# EAGLE design led-er (EAGLE 7.2.0)
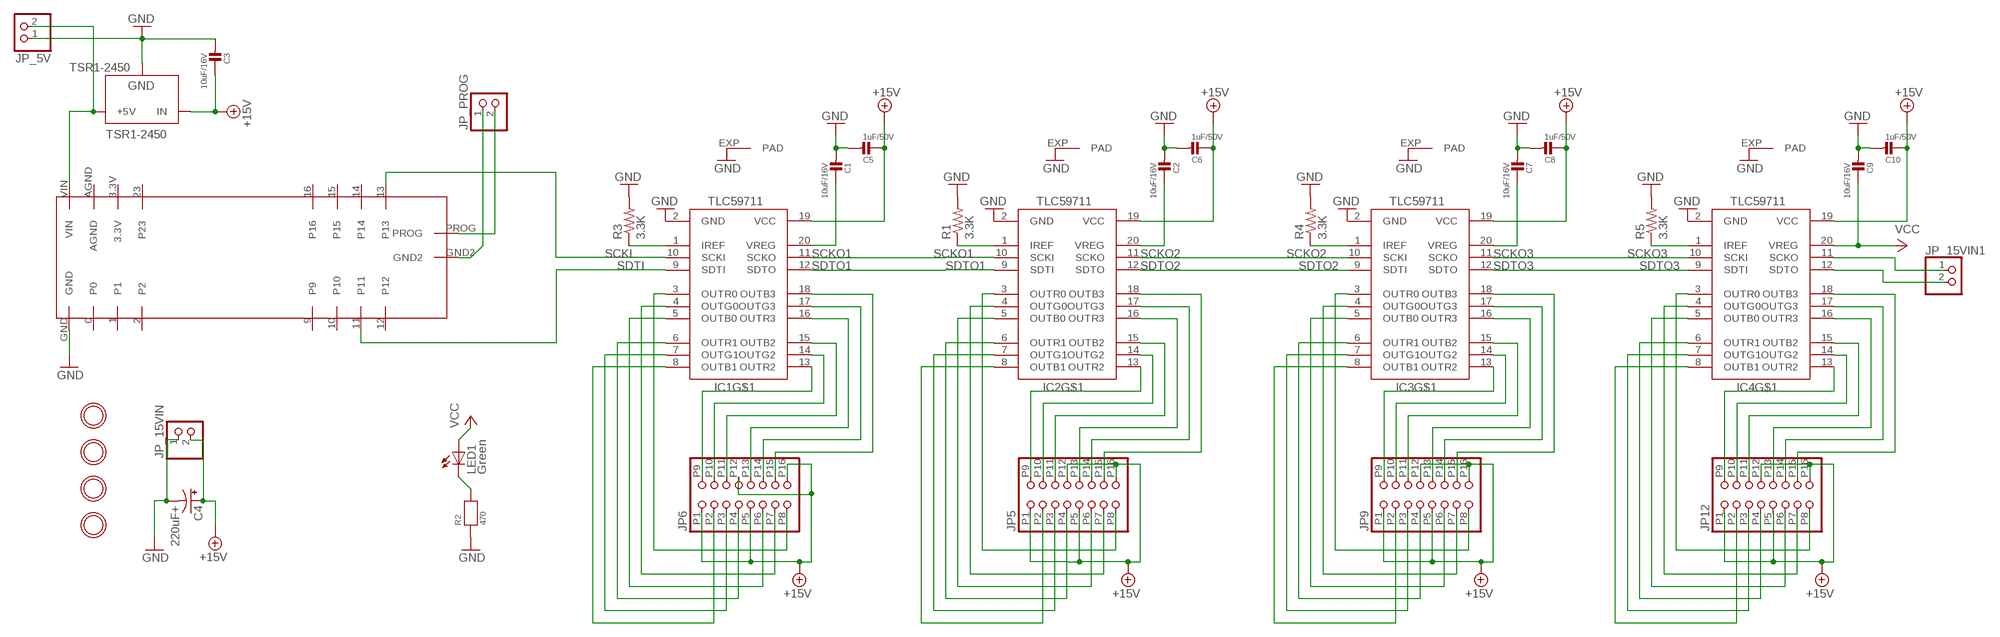
[diagram p0: schematic, sheet 1]

## Parts
C1  10uF/16V  CAP_CERAMIC0805  [0805]
C2  10uF/16V  CAP_CERAMIC0805  [0805]
C3  10uF/16V  CAP_CERAMIC0805  [0805]
C4  220uF+  CPOL-USE5-8.5  [E5-8,5]
C5  1uF/50V  CAP_CERAMIC0805  [0805]
C6  1uF/50V  CAP_CERAMIC0805  [0805]
C7  10uF/16V  CAP_CERAMIC0805  [0805]
C8  1uF/50V  CAP_CERAMIC0805  [0805]
C9  10uF/16V  CAP_CERAMIC0805  [0805]
C10  1uF/50V  CAP_CERAMIC0805  [0805]
IC1  TLC59711  [HTSSOP20DAP]
IC2  TLC59711  [HTSSOP20DAP]
IC3  TLC59711  [HTSSOP20DAP]
IC4  TLC59711  [HTSSOP20DAP]
JP5  HEADER-2X8  [2X08]
JP6  HEADER-2X8  [2X08]
JP9  HEADER-2X8  [2X08]
JP12  HEADER-2X8  [2X08]
JP_5V  HEADER-1X2  [1X02_OVAL]
JP_15VIN  HEADER-1X2  [1X02_OVAL]
JP_15VIN1  HEADER-1X2  [1X02_OVAL]
JP_PROG  HEADER-1X2  [1X02_OVAL]
LED1  Green  LEDCHIP-LED0805  [CHIP-LED0805]
R1  3.3K  R-US_FLIPFLOP7  [0805-THM-7]
R2  470  RESISTOR0805  [0805]
R3  3.3K  R-US_FLIPFLOP7  [0805-THM-7]
R4  3.3K  R-US_FLIPFLOP7  [0805-THM-7]
R5  3.3K  R-US_FLIPFLOP7  [0805-THM-7]
TSR1-2450  TSR1-2450  [TSR-1]
U$1  MOUNTINGHOLE  [MOUNTINGHOLE_3.0_PLATED]
U$2  MOUNTINGHOLE  [MOUNTINGHOLE_3.0_PLATED]
U$3  MOUNTINGHOLE  [MOUNTINGHOLE_3.0_PLATED]
U$4  MOUNTINGHOLE  [MOUNTINGHOLE_3.0_PLATED]
U$5  TEENSY_LEDER  [TEENSY_LEDER]

## Nets
+15V: C3.1 C4.+ C5.1 C6.1 C8.1 C10.1 IC1.19(VCC) IC2.19(VCC) IC3.19(VCC) IC4.19(VCC) JP5.P1 JP5.P5 JP5.P12 JP5.P16 JP6.P1 JP6.P5 JP6.P12 JP6.P16 JP9.P1 JP9.P5 JP9.P12 JP9.P16 JP12.P1 JP12.P5 JP12.P12 JP12.P16 JP_15VIN.2 TSR1-2450.1(IN)
GND: C1.2 C2.2 C3.2 C4.- C5.2 C6.2 C7.2 C8.2 C9.2 C10.2 IC1.2(GND) IC1.EXP(PAD) IC2.2(GND) IC2.EXP(PAD) IC3.2(GND) IC3.EXP(PAD) IC4.2(GND) IC4.EXP(PAD) JP_5V.1 JP_15VIN.1 R1.2 R2.1 R3.2 R4.2 R5.2 TSR1-2450.2(GND) U$5.GND
JP1: JP_5V.2 TSR1-2450.3(+5V) U$5.VIN
N$1: LED1.C R2.2
N$2: IC1.1(IREF) R3.1
N$3: IC1.3(OUTR0) JP6.P8
N$4: IC1.4(OUTG0) JP6.P7
N$5: IC1.5(OUTB0) JP6.P6
N$6: IC1.6(OUTR1) JP6.P4
N$7: IC1.7(OUTG1) JP6.P3
N$8: IC1.8(OUTB1) JP6.P2
N$9: IC1.13(OUTR2) JP6.P9
N$10: IC1.14(OUTG2) JP6.P10
N$11: IC1.15(OUTB2) JP6.P11
N$12: IC1.16(OUTR3) JP6.P13
N$13: IC1.17(OUTG3) JP6.P14
N$14: IC1.18(OUTB3) JP6.P15
N$15: IC2.1(IREF) R1.1
N$16: IC2.3(OUTR0) JP5.P8
N$17: IC2.4(OUTG0) JP5.P7
N$18: IC2.5(OUTB0) JP5.P6
N$19: IC2.6(OUTR1) JP5.P4
N$20: IC2.7(OUTG1) JP5.P3
N$21: IC2.8(OUTB1) JP5.P2
N$22: IC2.13(OUTR2) JP5.P9
N$23: IC2.14(OUTG2) JP5.P10
N$24: IC2.15(OUTB2) JP5.P11
N$25: IC2.16(OUTR3) JP5.P13
N$26: IC2.17(OUTG3) JP5.P14
N$27: IC2.18(OUTB3) JP5.P15
N$28: IC3.1(IREF) R4.1
N$29: IC3.3(OUTR0) JP9.P8
N$30: IC3.4(OUTG0) JP9.P7
N$31: IC3.5(OUTB0) JP9.P6
N$32: IC3.6(OUTR1) JP9.P4
N$33: IC3.7(OUTG1) JP9.P3
N$34: IC3.8(OUTB1) JP9.P2
N$35: IC3.13(OUTR2) JP9.P9
N$36: IC3.14(OUTG2) JP9.P10
N$37: IC3.15(OUTB2) JP9.P11
N$38: IC3.16(OUTR3) JP9.P13
N$39: IC3.17(OUTG3) JP9.P14
N$40: IC3.18(OUTB3) JP9.P15
N$41: IC4.1(IREF) R5.1
N$42: IC4.3(OUTR0) JP12.P8
N$43: IC4.4(OUTG0) JP12.P7
N$44: IC4.5(OUTB0) JP12.P6
N$45: IC4.6(OUTR1) JP12.P4
N$46: IC4.7(OUTG1) JP12.P3
N$47: IC4.8(OUTB1) JP12.P2
N$48: IC4.13(OUTR2) JP12.P9
N$49: IC4.14(OUTG2) JP12.P10
N$50: IC4.15(OUTB2) JP12.P11
N$51: IC4.16(OUTR3) JP12.P13
N$52: IC4.17(OUTG3) JP12.P14
N$53: IC4.18(OUTB3) JP12.P15
N$54: JP_PROG.1 U$5.GND2
N$55: JP_PROG.2 U$5.PROG
N$56: C1.1 IC1.20(VREG)
N$57: C7.1 IC3.20(VREG)
N$58: C2.1 IC2.20(VREG)
N$59: IC4.11(SCKO) JP_15VIN1.1
N$60: IC4.12(SDTO) JP_15VIN1.2
SCKI: IC1.10(SCKI) U$5.13
SCKO1: IC1.11(SCKO) IC2.10(SCKI)
SCKO2: IC2.11(SCKO) IC3.10(SCKI)
SCKO3: IC3.11(SCKO) IC4.10(SCKI)
SDTI: IC1.9(SDTI) U$5.11
SDTO1: IC1.12(SDTO) IC2.9(SDTI)
SDTO2: IC2.12(SDTO) IC3.9(SDTI)
SDTO3: IC3.12(SDTO) IC4.9(SDTI)
VCC: C9.1 IC4.20(VREG) LED1.A
Unconnected: U$5.0 U$5.1 U$5.2 U$5.3.3V U$5.9 U$5.10 U$5.12 U$5.14 U$5.15 U$5.16 U$5.23 U$5.AGND

## Library data of the parts
C1-C3 C5-C10 = microbuilder:CAP_CERAMIC: Ceramic Capacitors For new designs, use the packages preceded by an '_' character since they are more reliable: The following footprints should be used on most boards: _0402 - Standard footprint for regular board layouts _0603 - Standard footprint for regular board layouts _0805 - Standard footprint for regular board layouts For extremely tight-pitch boards where space is at a premium, the following 'micro-pitch' footprints can be used (smaller pads, no silkscreen outline, etc.): _0402MP - Micro-pitch footprint for very dense/compact boards _0603MP - Micro-pitch footprint for very dense/compact boards _0805MP - Micro-pitch footprint for very dense/compact boards Commonly Stocked Parts 0402 - 0402 Surface Mount Capacitors 16pF 50V 5% [Digikey: 445-4899-2-ND] 18pF 50V 5% [Digikey: 490-1281-2-ND] 22pF 50V 5% [Digikey: 490-1283-2-ND] 68pF 50V 5% [Digikey: 490-1289-2-ND] 0.1uF 10V 10% [Digikey: 490-1318-2-ND] 1.0uF 6.3V 10% [Digikey: 490-1320-2-ND] 0603 - 0603 Surface Mount Capacitors 16 pF 50V 5% [Digikey: 445-5051-2-ND] 22 pF 50V [Digikey: PCC220ACVTR-ND] 33 pF 50V 5% [Digikey: 490-1415-1-ND] 56pF 50V 5% [Digikey: 490-1421-1-ND] 220pF 50V 5% [Digikey: 445-1285-1-ND] 680 pF 50V 2200 pF 50V 5% C0G [Digikey: 445-1297-1-ND] 5600 pF 100V 5% X7R [Digikey: 478-3711-1-ND] 0.1 µF 25V 10% [Digikey: PCC2277TR-ND] 0.22 µF 16V 10% X7R [Digikey: 445-1318-1-ND] 1.0 µF 25V 10% [Digikey: 445-5146-2-ND] 0603 - RF Specific 3pF 250V +/-0.1pF RF [Digikey: 712-1347-1-ND] 18 pF 250V 5% [Digikey: 478-3505-1-ND or 712-1322-1-ND] 56 pF 250V 5% C0G RF [Digikey: 490-4867-1-ND] 68 pF 250V RF [Digikey: 490-4868-1-ND] 0805 - 0805 Surface Mount Capacitors 220 pF 250V 2% RF Ceramic Capacitor [Digikey: 712-1398-1-ND] 1000 pF 50V 2% NP0 Ceramic Capacitor [Digikey: 478-3760-1-ND] 0.1 µF 25V 10% Ceramic Capacitor [Digikey: PCC1828TR-ND] 1.0 µF 16V 10% Ceramic Capacitor[Digikey: 490-1691-2-ND] 10.0 µF 10V 10% Ceramic Capacitor[Digikey: 709-1228-1-ND] 10.0 uF 16V 10% Ceramic Capacitor [Digikey: 478-5165-2-ND] 47 uF 6.3V 20% Ceramic Capacitor [Digikey: 587-1779-1-ND or 399-5506-1-ND] 1206 - 1206 Surface Mount Capacitors 47uF 10V 20% Ceramic Capacitor [Digikey: 490-5528-1-ND or 399-5508-1-ND or 445-6010-1-ND] 100uF 6.3V -20%, +80% Y5V Ceramic Capacitor (Digikey: 490-4512-1-ND, Mouser: 81-GRM31CF50J107ZE1L)
C4 = adafruit:CPOL-US: POLARIZED CAPACITOR, American symbol
IC1-IC4 = adafruit:TLC59711
JP5 JP6 JP9 JP12 = Andrews:HEADER-2X8: 2x8 shrouded header
JP_5V JP_15VIN JP_15VIN1 JP_PROG = microbuilder:HEADER-1X2: PIN HEADER
LED1 = adafruit:LED: LED OSRAM: - CHIPLED LG R971, LG N971, LY N971, LG Q971, LY Q971, LO R971, LY R971 LH N974, LH R974 LS Q976, LO Q976, LY Q976 LO Q996 - Hyper CHIPLED LW Q18S LB Q993, LB Q99A, LB R99A - SideLED LS A670, LO A670, LY A670, LG A670, LP A670 LB A673, LV A673, LT A673, LW A673 LH A674 LY A675 LS A676, LA A676, LO A676, LY A676, LW A676 LS A679, LY A679, LG A679 - Hyper Micro SIDELED® LS Y876, LA Y876, LO Y876, LY Y876 LT Y87S - SmartLED LW L88C, LW L88S LB L89C, LB L89S, LG L890 LS L89K, LO L89K, LY L89K LS L896, LA L896, LO L896, LY L896 - TOPLED LS T670, LO T670, LY T670, LG T670, LP T670 LSG T670, LSP T670, LSY T670, LOP T670, LYG T670 LG T671, LOG T671, LSG T671 LB T673, LV T673, LT T673, LW T673 LH T674 LS T676, LA T676, LO T676, LY T676, LB T676, LH T676, LSB T676, LW T676 LB T67C, LV T67C, LT T67C, LS T67K, LO T67K, LY T67K, LW E67C LS E67B, LA E67B, LO E67B, LY E67B, LB E67C, LV E67C, LT E67C LW T67C LS T679, LY T679, LG T679 LS T770, LO T770, LY T770, LG T770, LP T770 LB T773, LV T773, LT T773, LW T773 LH T774 LS E675, LA E675, LY E675, LS T675 LS T776, LA T776, LO T776, LY T776, LB T776 LHGB T686 LT T68C, LB T68C - Hyper Mini TOPLED® LB M676 - Mini TOPLED Santana® LG M470 LS M47K, LO M47K, LY M47K Source: http://www.osram.convergy.de/
R1 R3-R5 = adafruit:R-US_: RESISTOR, American symbol
R2 = microbuilder:RESISTOR: Resistors For new designs, use the packages preceded by an '_' character since they are more reliable: The following footprints should be used on most boards: _0402 - Standard footprint for regular board layouts _0603 - Standard footprint for regular board layouts _0805 - Standard footprint for regular board layouts For extremely tight-pitch boards where space is at a premium, the following 'micro-pitch' footprints can be used (smaller pads, no silkscreen outline, etc.): _0402MP - Micro-pitch footprint for very dense/compact boards _0603MP - Micro-pitch footprint for very dense/compact boards _0805MP - Micro-pitch footprint for very dense/compact boards
TSR1-2450 = SteelCaveRobotics-Power:TSR1-2450: Traco Power TSR 1-2450 5.0v switching regulator
U$1-U$4 = microbuilder:MOUNTINGHOLE: Mounting Hole For #2 screws (0.086"/2.18mm width, 0.094"/2.4mm hole) use 2.5mm
U$5 = Andrews:TEENSY_LEDER

## Board
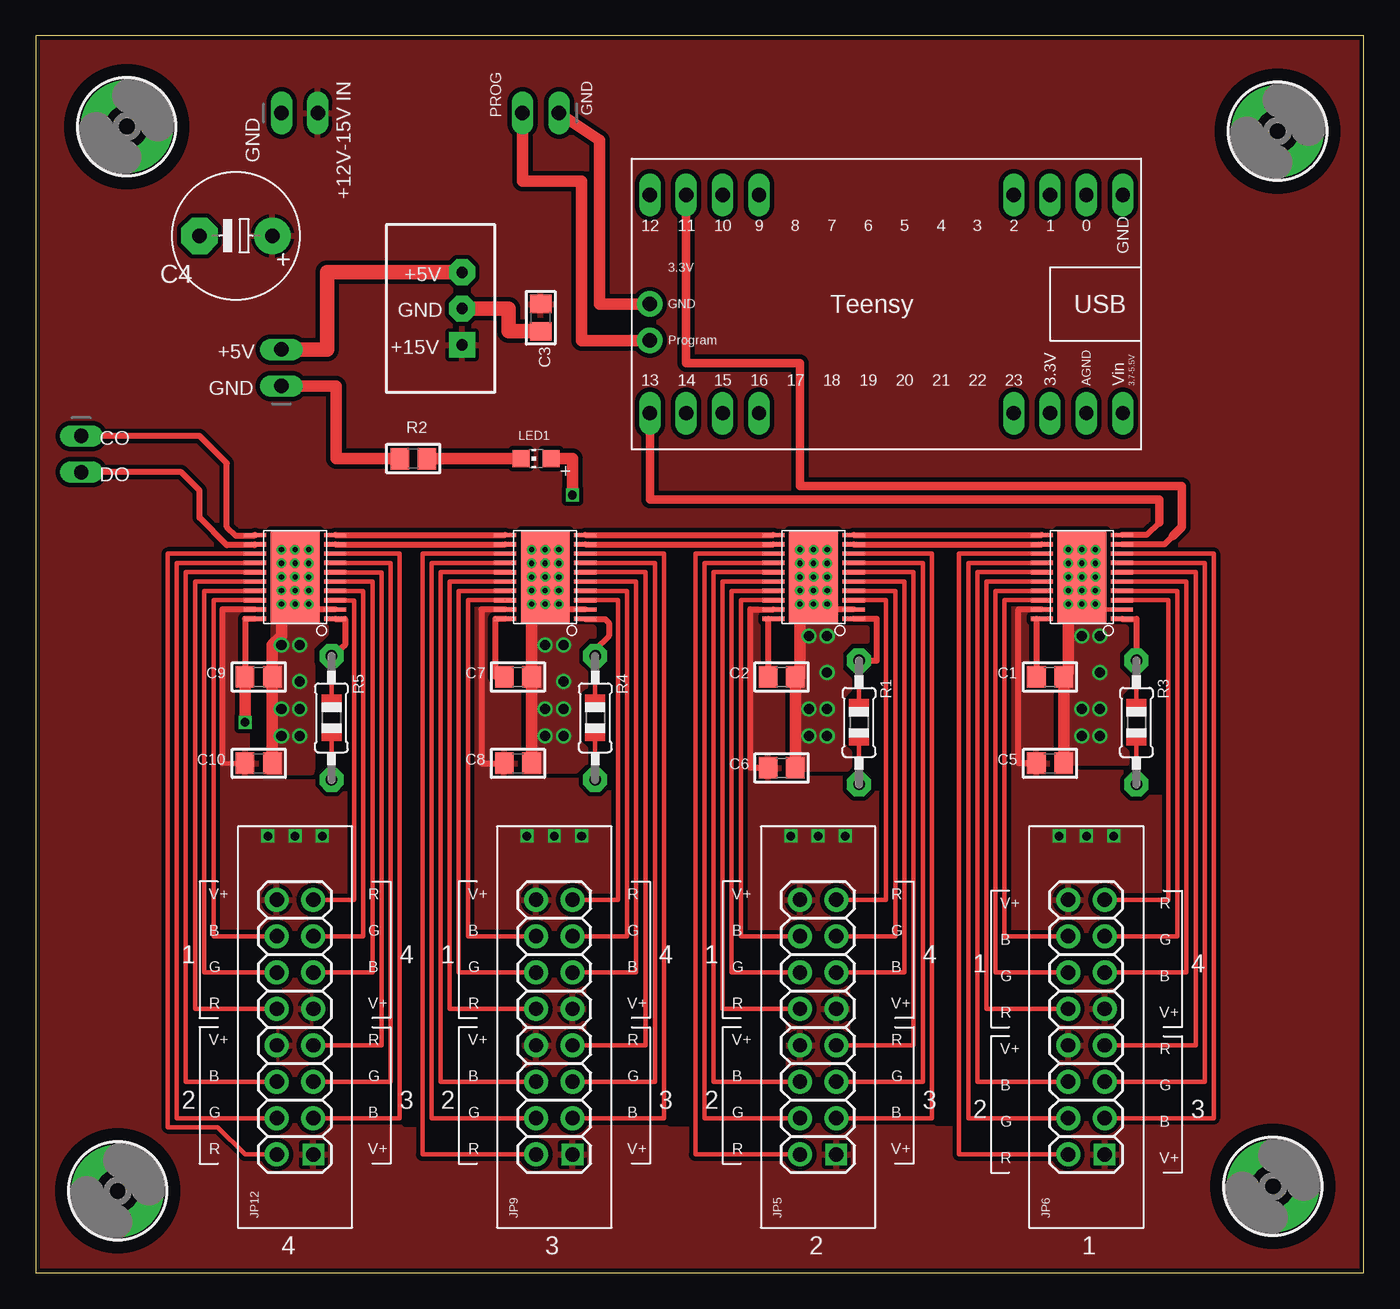
[diagram p1: board, top side]
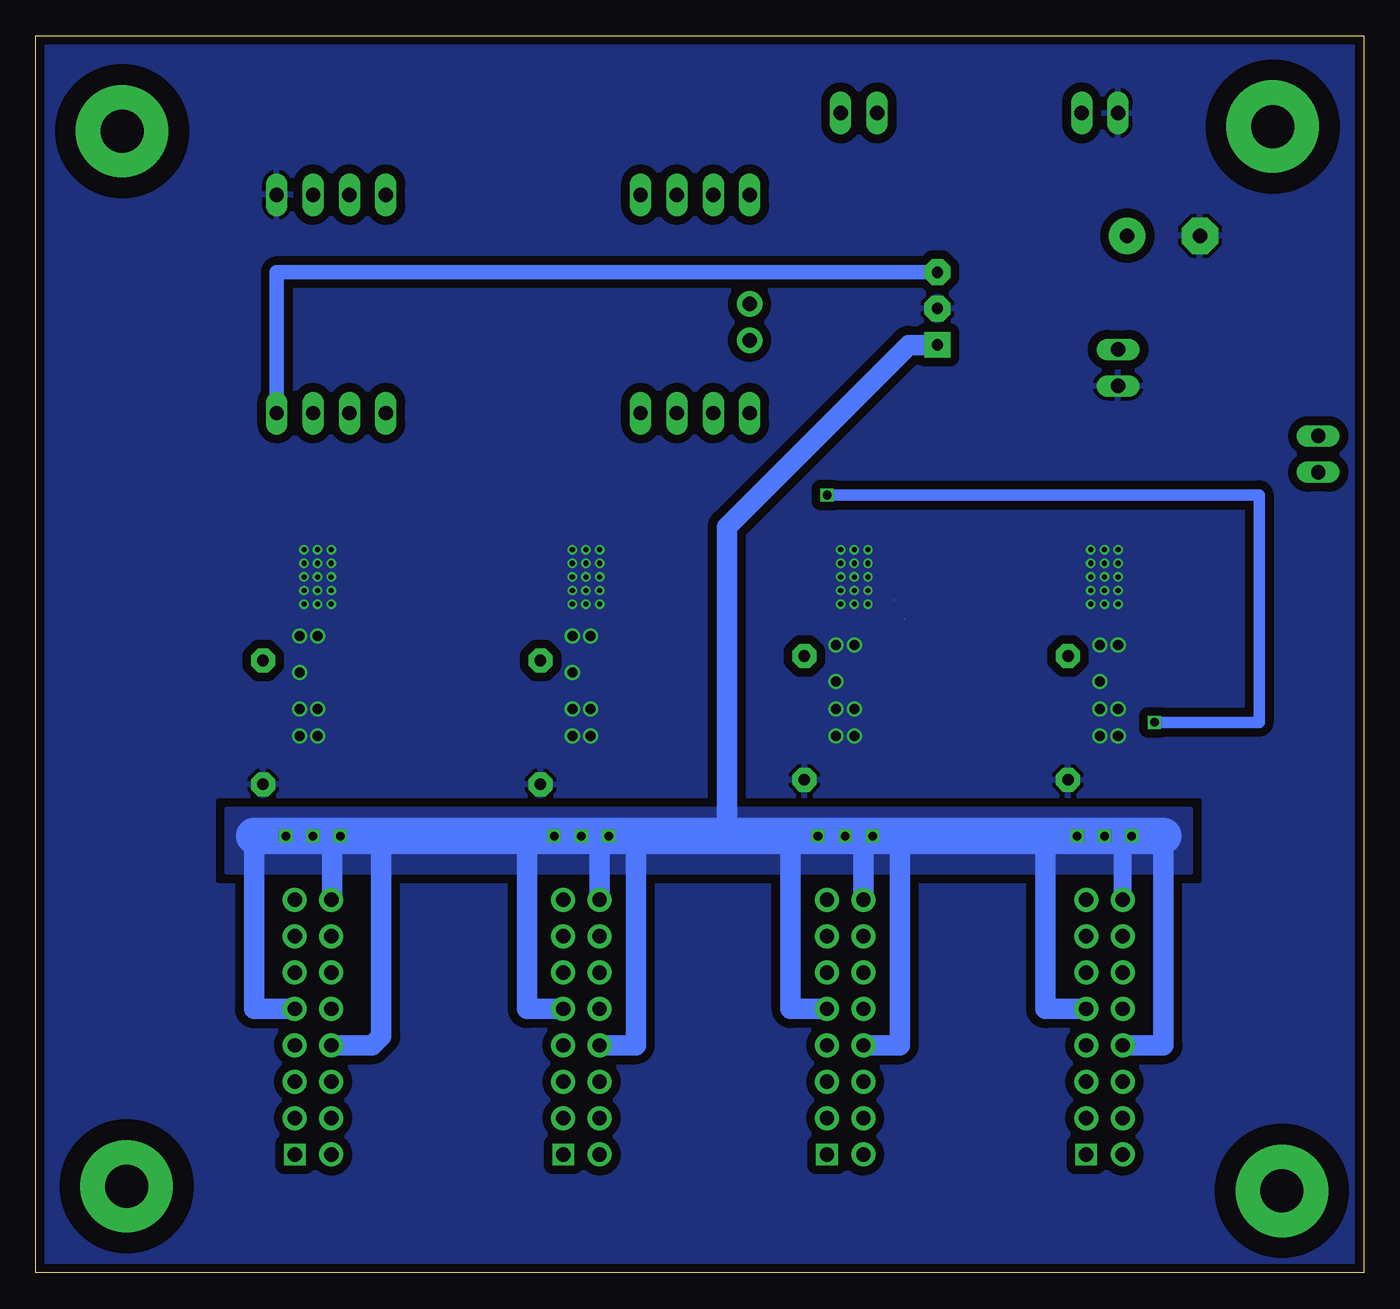
[diagram p2: board, bottom side, seen from below]

Size 92.7 x 86.35 mm. Coordinates in mm from the lower left corner, seen from the top.
Outline: 0,0 92.7,0 92.7,86.35 0,86.35 0,0
Copper layers (1*16): Top 0.035mm / dielectric 1.5mm / Bottom 0.035mm
Design rules "SeeedStudio_2layer_DRU_no_angle_20140221": minimum track width 6mil, minimum drill 12mil, track to track 6mil, track to pad 6mil, pad to pad 6mil, via to via 6mil, smd to smd 0mil, copper to edge 10mil, drill to drill 10mil, minimum pad ring 10mil, minimum via ring 6mil, stop-mask expansion 2mil, vias tented up to drill 100mil, thermal gap 10mil
tRestrict: area 10.8,14 to 16.5,17.8; area 19.7,16.5 to 23.5,20.3; area 28.6,14 to 33.7,17.8; area 38.7,16.5 to 41.9,20.3; area 47.6,14 to 52.1,17.8; area 57.1,16.5 to 61,20.3; area 66,14 to 71.1,17.8; area 75.6,16.5 to 80.6,20.3; area 25.8,10.4 to 26.5,12.7; area 44.3,10.5 to 45.5,12.6; area 63,10.6 to 63.9,12.8; area 15.2,36.6 to 15.8,37.7; 1 more areas

### Footprints (pad centres in the part's own frame; a part is rotated, then mirrored left to right if it is on the bottom)
0805 = smd 1.3 x 1.5: 1 -0.95,0; 2 0.95,0
E5-8,5 = drill 1.016 pad 2.54: + -2.54,0 | drill 1.016 pad 2.54 octagon: - 2.54,0
HTSSOP20DAP = smd 0.3 x 1.55: 1 -2.925,-2.8; 2 -2.275,-2.8; 3 -1.625,-2.8; 4 -0.975,-2.8; 5 -0.325,-2.8; 6 0.325,-2.8; 7 0.975,-2.8; 8 1.625,-2.8; 9 2.275,-2.8; 10 2.925,-2.8; 11 2.925,2.8; 12 2.275,2.8; 13 1.625,2.8; 14 0.975,2.8; 15 0.325,2.8; 16 -0.325,2.8; 17 -0.975,2.8; 18 -1.625,2.8; 19 -2.275,2.8; 20 -2.925,2.8 | smd 6.5 x 3.4: EXP 0,0
2X08 = drill 1 square: P1 -8.89,-1.27 | drill 1 pad 1.676: P2 -6.35,-1.27; P3 -3.81,-1.27; P4 -1.27,-1.27; P5 1.27,-1.27; P6 3.81,-1.27; P7 6.35,-1.27; P8 8.89,-1.27; P9 -8.89,1.27; P10 -6.35,1.27; P11 -3.81,1.27; P12 -1.27,1.27; P13 1.27,1.27; P14 3.81,1.27; P15 6.35,1.27; P16 8.89,1.27
1X02_OVAL = drill 1 long: 1 -1.27,0; 2 1.27,0
CHIP-LED0805 = smd 1.2 x 1.2: A 0,-1.05; C 0,1.05
0805-THM-7 = drill 0.813 pad 1.676 octagon: 1 -4.318,0; 2 4.318,0
TSR-1 = drill 0.8 pad 1.8 square: 1 -2.54,-1.5 | drill 0.8 pad 1.8 octagon: 2 0,-1.5; 3 2.54,-1.5
MOUNTINGHOLE_3.0_PLATED = drill 3 pad 6.452: P$1 0,0
TEENSY_LEDER = drill 1 pad 1.422 long: 0 12.7,7.62; 1 10.16,7.62; 2 7.62,7.62; 3.3V 10.16,-7.62; 9 -10.16,7.62; 10 -12.7,7.62; 11 -15.24,7.62; 12 -17.78,7.62; 13 -17.78,-7.62; 14 -15.24,-7.62; 15 -12.7,-7.62; 16 -10.16,-7.62; 23 7.62,-7.62; AGND 12.7,-7.62; GND 15.24,7.62; VIN 15.24,-7.62 | drill 1 pad 1.778: GND2 -17.78,0; PROG -17.78,-2.54

### Placement (x,y rotation side)
C1  70.8,41.59 0 top
C2  52.07,41.59 0 top
C3  35.24,66.67 270 top
C4  13.97,72.39 180 top
C5  70.8,35.56 0 top
C6  52.07,35.24 0 top
C7  33.66,41.59 0 top
C8  33.66,35.56 0 top
C9  15.56,41.59 0 top
C10  15.56,35.56 0 top
IC1  73.03,48.58 90 top
IC2  54.29,48.58 90 top
IC3  35.56,48.58 90 top
IC4  18.1,48.58 90 top
JP5  54.61,17.14 90 top
JP6  73.34,17.14 90 top
JP9  36.2,17.14 90 top
JP12  18.1,17.14 90 top
JP_5V  17.14,63.18 90 top
JP_15VIN  18.41,80.96 0 top
JP_15VIN1  3.17,57.15 270 top
JP_PROG  35.24,80.96 180 top
LED1  34.92,56.83 90 top
R1  57.47,38.42 270 top
R2  26.35,56.83 0 top
R3  76.83,38.42 270 top
R4  39.05,38.73 270 top
R5  20.64,38.73 270 top
TSR1-2450  28.26,67.31 90 top
U$1  86.68,79.69 0 top
U$2  5.71,5.71 0 top
U$3  86.36,6.03 0 top
U$4  6.35,80.01 0 top
U$5  60.64,67.63 0 top

### Tracks (layer width: path | path; a pad name or v marks a point on that pad's centre or on a via)
+15V  (via drill 0.6)
  Top 0.305: 13.02,35.56 C10.1
  Top 0.406: IC4.19 13.02,46.3 13.02,35.56 | C6.1 49.88,35.24 49.88,46.3 IC2.19 | C5.1 68.6,35.56 68.6,46.3 | IC3.19 31.11,46.3 31.11,35.56 32.38,35.56 | IC1.19 68.6,46.3 | 68.6,46.3 68.6,46.31
  Bottom 1.27: JP12.P16 16.8,26.06 16.8,30.48
  Bottom 1.422: 77.47,30.48 77.47,18.41 JP6.P5 | JP12.P5 22.23,18.41 22.23,30.48 | JP12.P12 13.97,15.88 13.97,30.48 | JP9.P16 34.92,30.48 | JP9.P5 40.01,18.41 40.01,30.48 | JP9.P12 32.38,15.88 32.38,30.48 | JP5.P16 53.34,30.48 | JP5.P5 58.42,18.41 58.42,30.48 | JP5.P12 50.8,15.88 50.8,30.48 | JP6.P16 72,26.11 72,30.48 | JP6.P12 69.22,15.88 68.58,16.51 68.58,30.48 | 45.09,30.48 44.45,31.11 44.45,52.07 31.75,64.77 TSR1-2450.1
  Bottom 2.54: 13.97,30.48 v16.19,30.48 16.8,30.48 v18.1,30.48 v20,30.48 22.23,30.48 32.38,30.48 v34.29,30.48 34.92,30.48 v36.2,30.48 v38.1,30.48 40.01,30.48 45.09,30.48 50.8,30.48 v52.7,30.48 53.34,30.48 v54.61,30.48 v56.52,30.48 58.42,30.48 68.58,30.48 72,30.48 v73.34,30.48 v75.25,30.48 77.47,30.48
  other vias: 71.44,30.48
  pour Top (isolate 0.305, rank 2): 0,86.36 0,0 92.71,0 92.71,86.36
  pour Bottom: 12.06,32.38 12.06,27.94 79.38,27.94 79.38,32.38
GND  (via drill 0.36, 0.7)
  Top 0.305: IC3.2 | 36.51,46.3 36.51,46.31 v36.51,46.67 36.51,46.99 | 19.42,46.3 v19.05,46.67 v18.1,46.67 17.14,45.72 | C9.2 | 55.62,46.3 v55.24,46.67 | C2.2 53.34,41.59 | IC1.2 73.98,46.3 v73.98,46.67 | 72.07,41.91 71.75,41.91 C1.2
  Top 0.406: IC3.2 36.51,46.3 | IC4.2 19.42,46.3 | 36.51,46.99 35.88,46.99 34.61,45.72 | C7.2 | IC2.2 55.62,46.3
  Top 0.813: C9.2 C10.2 | C8.2 C7.2 | 17.14,45.72 17.14,44.45 16.51,43.81 C9.2 | C7.2 34.61,45.72 v34.61,46.67 v36.51,46.67 | 53.34,41.59 v53.34,46.67 | C6.2 C2.2 | v72.07,46.67 72.07,41.91 | C1.2 C5.2 | JP_5V.1 20.95,61.91 20.95,56.83 R2.1
  Top 1.016: C3.2 33.02,65.72 33.02,67.31 TSR1-2450.2
  other vias: 18.1,48.58 17.14,50.48 18.1,50.48 19.05,50.48 17.14,49.53 18.1,49.53 19.05,49.53 17.14,48.58 19.05,48.58 17.14,47.62 18.1,47.62 19.05,47.62 17.14,46.67 35.56,48.58 34.61,48.58 36.51,48.58 34.61,49.53 35.56,49.53 36.51,49.53 34.61,50.48 35.56,50.48 36.51,50.48 34.61,47.62 35.56,47.62 35.56,46.67 36.51,47.62 54.29,48.58 53.34,48.58 55.24,48.58 55.24,49.53 54.29,49.53 53.34,49.53 53.34,47.62 54.29,47.62 55.24,47.62 54.29,46.67 55.24,50.48 54.29,50.48 53.34,50.48 73.03,48.58 73.98,48.58 72.07,48.58 72.07,47.62 73.03,47.62 73.98,47.62 73.03,46.67 72.07,49.53 73.03,49.53 73.98,49.53 73.98,50.48 73.03,50.48 72.07,50.48 17.14,43.81 18.41,43.81 18.41,41.27 17.14,39.37 18.41,39.37 17.14,37.47 18.41,37.47 35.56,43.81 36.83,43.81 36.83,41.27 35.56,39.37 36.83,39.37 35.56,37.47 36.83,37.47 53.98,44.45 55.24,44.45 55.24,41.91 53.98,39.37 55.24,39.37 53.98,37.47 55.24,37.47 73.03,44.45 74.3,44.45 74.3,41.91 73.03,39.37 74.3,39.37 73.03,37.47 74.3,37.47
  pour Bottom (isolate 0.61, rank 2): 0,86.36 0,0 92.71,0 92.71,86.36
  pour Top (no thermals): 16.55,45.6 16.55,44.78 16.2,34.9 19.3,34.9 19.35,35.25 19.35,42.35 19.3,42.6 19.3,43.6 20.3,44.6 20.3,45.1 20,45.1 19.6,45.5
  pour Top (no thermals): 34,45.5 34.73,45.4 34.63,34.95 34.9,34.95 37.7,35 38.3,35.6 38.4,35.6 38.4,36.6 37.9,37.1 37.9,40.5 38.3,40.9 38.4,40.9 38.4,41.9 37.8,42.5 37.8,43.6 38.6,44.4 39,44.4 39,45 38.9,45.1 37.3,45.1 36.8,45.6 36.8,45.7 34.1,45.7 34,45.6
  pour Top (no thermals): 53.38,45.45 53.5,44.62 53.19,35.2 53.23,35.15 56.65,35.15 56.85,35.35 56.85,36.35 56.35,36.85 56.35,40.2 56.85,40.7 56.85,41.4 56.2,42.05 56.2,43.35 56.9,44.05 58.05,44.05 58.05,45 58,45.05 56.15,45.05 55.75,45.45
  pour Top (no thermals): 72.08,45.45 72.08,35.6 71.5,35.55 76.2,35.55 76.2,36.35 75.75,36.8 75.75,40.4 76.25,40.9 76.25,41.45 75.55,42.15 75.55,43.35 76.15,43.95 76.15,45 76.05,45.1 74.8,45.1 74.45,45.45
JP1
  Top 1.016: TSR1-2450.3 20.32,69.85 20.32,64.45 JP_5V.2
  Bottom 1.016: TSR1-2450.3 75.88,69.85 U$5.VIN
N$1
  Top 0.813: R2.2 LED1.C
N$2
  Top 0.406: IC1.1 76.83,45.65 R3.1
N$3
  Top 0.305: IC1.3 79.06,46.95 79.06,26.04 JP6.P8
N$4
  Top 0.305: IC1.4 79.69,47.6 79.69,23.5 JP6.P7
N$5
  Top 0.305: IC1.5 80.33,48.25 80.33,20.95 JP6.P6
N$6
  Top 0.305: IC1.6 80.96,48.9 80.96,15.88 JP6.P4
N$7
  Top 0.305: IC1.7 81.6,49.55 81.6,13.34 JP6.P3
N$8
  Top 0.305: IC1.8 82.23,50.2 82.23,10.79 JP6.P2
N$9
  Top 0.305: IC1.13 64.45,50.2 64.45,8.26 JP6.P9
N$10
  Top 0.305: IC1.14 65.09,49.55 65.09,10.79 JP6.P10
N$11
  Top 0.305: IC1.15 65.72,48.9 65.72,13.34 JP6.P11
N$12
  Top 0.305: IC1.16 66.36,48.25 66.36,18.41 JP6.P13
N$13
  Top 0.305: IC1.17 66.99,47.6 66.99,20.95 JP6.P14
N$14
  Top 0.305: IC1.18 67.63,46.95 67.63,23.5 JP6.P15
N$15
  Top 0.305: IC2.1
  Top 0.406: R1.1 58.7,42.74 58.7,45.65 IC2.1
N$16
  Top 0.305: JP5.P8 59.34,26.04 59.34,46.95 IC2.3
N$17
  Top 0.305: IC2.4 60.01,47.6 60.01,23.5 JP5.P7
N$18
  Top 0.305: IC2.5 60.64,48.25 60.64,20.95 JP5.P6
N$19
  Top 0.305: IC2.6 61.28,48.9 61.28,15.88 JP5.P4
N$20
  Top 0.305: IC2.7 61.91,49.55 61.91,13.34 JP5.P3
N$21
  Top 0.305: IC2.8 62.55,50.2 62.55,10.79 JP5.P2
N$22
  Top 0.305: IC2.13 46.04,50.2 46.04,8.26 JP5.P9
N$23
  Top 0.305: IC2.14 46.67,49.55 46.67,10.79 JP5.P10
N$24
  Top 0.305: IC2.15 47.31,48.9 47.31,13.34 JP5.P11
N$25
  Top 0.305: IC2.16 47.94,48.25 47.94,18.41 JP5.P13
N$26
  Top 0.305: IC2.17 48.58,47.6 48.58,20.95 JP5.P14
N$27
  Top 0.305: IC2.18 49.21,46.95 49.21,23.5 JP5.P15
N$28
  Top 0.305: IC3.1 38.38,45.63
  Top 0.406: 38.38,45.63 39.74,45.63 40.01,45.37 40.01,44.45 39.05,43.5 R4.1
N$29
  Top 0.305: JP9.P8 40.65,26.04 40.65,46.95 IC3.3
N$30
  Top 0.305: JP9.P7 41.29,23.5 41.29,47.61 IC3.4
N$31
  Top 0.305: JP9.P6 41.9,20.95 41.9,48.25 IC3.5 | IC3.5
N$32
  Top 0.305: JP9.P4 42.55,15.88 42.55,48.91 IC3.6
N$33
  Top 0.305: JP9.P3 43.22,13.34 43.22,49.56 IC3.7
N$34
  Top 0.305: JP9.P2 43.84,10.79 43.84,50.2 IC3.8 | IC3.8
N$35
  Top 0.305: IC3.13 26.99,50.2 26.99,8.26 JP9.P9
N$36
  Top 0.305: IC3.14 27.62,49.55 27.62,10.79 JP9.P10
N$37
  Top 0.305: IC3.15 28.26,48.9 28.26,13.34 JP9.P11
N$38
  Top 0.305: IC3.16 28.89,48.25 28.89,18.41 JP9.P13
N$39
  Top 0.305: IC3.17 29.53,47.6 29.53,20.95 JP9.P14
N$40  (1 unrouted)
  Top 0.305: JP9.P15 30.17,23.5 30.17,46.95 IC3.18
N$41
  Top 0.406: IC4.1 21.59,45.65 21.59,43.81 R5.1
N$42
  Top 0.305: JP12.P8 22.23,26.04 22.23,46.94 IC4.3
N$43
  Top 0.305: JP12.P7 22.83,23.5 22.83,47.61 IC4.4
N$44
  Top 0.305: JP12.P6 23.5,20.95 23.5,48.26 IC4.5
N$45
  Top 0.305: JP12.P4 24.13,15.88 24.13,48.9 IC4.6
N$46
  Top 0.305: IC4.7 24.77,49.55 24.77,13.34 JP12.P3
N$47
  Top 0.305: IC4.8 25.4,50.2 25.4,10.79 JP12.P2
N$48
  Top 0.305: IC4.13 9.21,50.2 9.21,10.16 12.7,10.16 14.61,8.26 JP12.P9
N$49
  Top 0.305: IC4.14 9.84,49.55 9.84,10.79 JP12.P10
N$50
  Top 0.305: IC4.15 10.48,48.9 10.48,13.34 JP12.P11
N$51
  Top 0.305: JP12.P13 11.11,18.41 11.11,48.26 IC4.16
N$52
  Top 0.305: JP12.P14 11.74,20.95 11.74,47.59 IC4.17
N$53
  Top 0.305: JP12.P15 12.41,23.5 12.41,46.96 IC4.18
N$54
  Top 0.813: U$5.GND2 39.37,67.63 39.37,79.06 JP_PROG.1
N$55
  Top 0.813: U$5.PROG 38.1,65.09 38.1,76.2 33.97,76.2 JP_PROG.2
N$56
  Top 0.305: IC1.20 69.85,45.65
  Top 0.406: 69.85,45.65 C1.1
N$57  (1 unrouted)
  Top 0.305: 32.06,41.6 32.07,41.59 C7.1
  Top 0.406: IC3.20 32.07,45.65 | 32.06,45.65 32.06,41.6
N$58
  Top 0.305: IC2.20 51.12,45.65
  Top 0.406: 51.12,45.65 C2.1
N$59
  Top 0.406: IC4.11 15.23,51.44 13.97,51.44 13.34,52.07 13.34,56.52 11.43,58.42 JP_15VIN1.1
N$60
  Top 0.406: IC4.12 15.24,50.8 13.34,50.8 11.43,52.7 11.43,54.61 10.16,55.88 JP_15VIN1.2
SCKI
  Top 0.406: 78.42,52.39 77.54,51.5 IC1.10
  Top 0.61: U$5.13 42.86,53.98 78.42,53.98 78.42,52.39
SCKO1
  Top 0.406: IC2.10 IC1.11
SCKO2
  Top 0.406: IC3.10 IC2.11
SCKO3
  Top 0.406: IC4.10 IC3.11
SDTI
  Top 0.406: IC1.9 78.79,50.85 79.38,51.44
  Top 0.61: U$5.11 45.4,63.5 53.34,63.5 53.34,54.93 80.01,54.93 80.01,52.07 79.38,51.44
SDTO1
  Top 0.406: IC2.9 IC1.12
SDTO2
  Top 0.406: IC3.9 IC2.12
SDTO3
  Top 0.406: IC4.9 IC3.12
VCC  (via drill 0.6)
  Top 0.406: IC4.20 14.61,45.65 C9.1 | v14.61,38.42
  Top 0.813: LED1.A 37.47,56.83 v37.47,54.29 | v14.61,38.42 C9.1
  Bottom 0.813: v37.47,54.29 7.3,54.29 7.3,38.42 v14.61,38.42

### Text on the board
tPlace: PROG | +12V-15V IN | GND | GND | +5V | GND | +5V | +15V | GND | CO | DO | V+ | R | V+ | R | V+ | R | V+ | R | B | G | B | G | B | G | B | G | 1 | 4 | 1 | 4 | 1 | 4 | G | B | G | B | G | B | 1 | 4 | G | B | R | V+ | R | V+ | R | V+ | R | V+ | V+ | R | V+ | R | V+ | R | V+ | R | B | G | B | G | B | G | B | G | 2 | G | B | 3 | 2 | G | B | 3 | 2 | G | B | 3 | 2 | 3 | G | B | R | V+ | R | V+ | R | V+ | R | V+ | 4 | 3 | 2 | 1